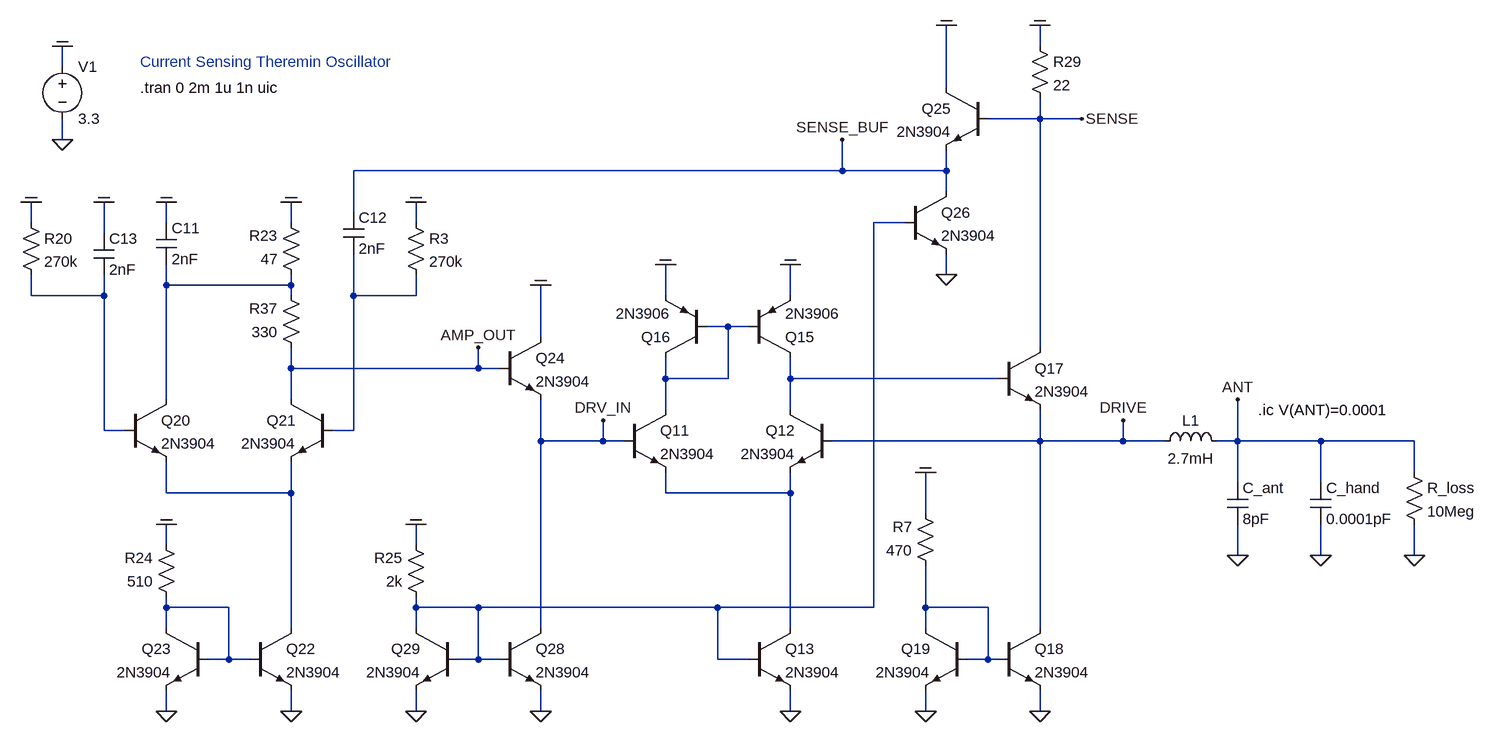
[diagram p0: schematic 2023_03_wallin_oscillator_bjt_diff_amp_volt_follower_buffer_v01.asc]
2023_03_wallin_oscillator_bjt_diff_amp_volt_follower_buffer_v01.asc, the LTspice schematic file:
Version 4
SHEET 1 16292 13396
WIRE 6640 9248 6640 9216
WIRE 5136 9280 5136 9248
WIRE 6496 9312 6496 9216
WIRE 6640 9360 6640 9328
WIRE 6640 9360 6560 9360
WIRE 6704 9360 6640 9360
WIRE 5136 9392 5136 9360
WIRE 6336 9440 6336 9392
WIRE 6336 9440 5584 9440
WIRE 6496 9440 6496 9408
WIRE 6496 9440 6336 9440
WIRE 6496 9472 6496 9440
WIRE 5584 9504 5584 9440
WIRE 5088 9520 5088 9488
WIRE 5296 9520 5296 9488
WIRE 5488 9520 5488 9488
WIRE 5680 9520 5680 9488
WIRE 6432 9520 6384 9520
WIRE 5200 9536 5200 9488
WIRE 6496 9600 6496 9568
WIRE 5296 9616 5296 9584
WIRE 5488 9616 5488 9600
WIRE 5488 9616 5296 9616
WIRE 5088 9632 5088 9600
WIRE 5200 9632 5200 9600
WIRE 5200 9632 5088 9632
WIRE 5488 9632 5488 9616
WIRE 5584 9632 5584 9568
WIRE 5680 9632 5680 9600
WIRE 5680 9632 5584 9632
WIRE 6064 9632 6064 9584
WIRE 6256 9632 6256 9584
WIRE 6160 9680 6128 9680
WIRE 6192 9680 6160 9680
WIRE 5872 9696 5872 9616
WIRE 6640 9712 6640 9360
WIRE 5488 9744 5488 9712
WIRE 5776 9744 5776 9712
WIRE 5776 9744 5488 9744
WIRE 5808 9744 5776 9744
WIRE 6064 9760 6064 9728
WIRE 6160 9760 6160 9680
WIRE 6160 9760 6064 9760
WIRE 6256 9760 6256 9728
WIRE 6576 9760 6256 9760
WIRE 5296 9792 5296 9616
WIRE 5488 9792 5488 9744
WIRE 6064 9808 6064 9760
WIRE 6256 9808 6256 9760
WIRE 5200 9840 5200 9632
WIRE 5232 9840 5200 9840
WIRE 5584 9840 5584 9632
WIRE 5584 9840 5552 9840
WIRE 5872 9856 5872 9792
WIRE 5968 9856 5968 9824
WIRE 5968 9856 5872 9856
WIRE 6000 9856 5968 9856
WIRE 6640 9856 6640 9808
WIRE 6640 9856 6320 9856
WIRE 6768 9856 6768 9824
WIRE 6768 9856 6640 9856
WIRE 6832 9856 6768 9856
WIRE 6944 9856 6944 9792
WIRE 6944 9856 6912 9856
WIRE 7072 9856 6944 9856
WIRE 7216 9856 7072 9856
WIRE 7216 9904 7216 9856
WIRE 6944 9920 6944 9856
WIRE 7072 9920 7072 9856
WIRE 5296 9936 5296 9888
WIRE 5488 9936 5488 9888
WIRE 5488 9936 5296 9936
WIRE 6064 9936 6064 9904
WIRE 6256 9936 6256 9904
WIRE 6256 9936 6064 9936
WIRE 6464 9968 6464 9904
WIRE 5296 10016 5296 9984
WIRE 5680 10016 5680 9984
WIRE 6944 10032 6944 9984
WIRE 7072 10032 7072 9984
WIRE 7216 10032 7216 9984
WIRE 5296 10112 5296 10096
WIRE 5392 10112 5296 10112
WIRE 5680 10112 5680 10096
WIRE 5776 10112 5680 10112
WIRE 6144 10112 5776 10112
WIRE 6384 10112 6384 9520
WIRE 6384 10112 6144 10112
WIRE 6464 10112 6464 10048
WIRE 6560 10112 6464 10112
WIRE 5296 10144 5296 10112
WIRE 5488 10144 5488 9936
WIRE 5680 10144 5680 10112
WIRE 5872 10144 5872 9856
WIRE 6256 10144 6256 9936
WIRE 6464 10144 6464 10112
WIRE 6640 10144 6640 9856
WIRE 5392 10192 5392 10112
WIRE 5392 10192 5360 10192
WIRE 5424 10192 5392 10192
WIRE 5776 10192 5776 10112
WIRE 5776 10192 5744 10192
WIRE 5808 10192 5776 10192
WIRE 6144 10192 6144 10112
WIRE 6192 10192 6144 10192
WIRE 6560 10192 6560 10112
WIRE 6560 10192 6528 10192
WIRE 6576 10192 6560 10192
WIRE 5296 10272 5296 10240
WIRE 5488 10272 5488 10240
WIRE 5680 10272 5680 10240
WIRE 5872 10272 5872 10240
WIRE 6256 10272 6256 10240
WIRE 6464 10272 6464 10240
WIRE 6640 10272 6640 10240
FLAG 5136 9392 0
FLAG 5136 9248 COM
FLAG 6944 10032 0
FLAG 6944 9792 ANT
FLAG 7072 10032 0
FLAG 7216 10032 0
FLAG 6768 9824 DRIVE
FLAG 6256 10272 0
FLAG 6064 9584 COM
FLAG 6256 9584 COM
FLAG 6640 9216 COM
FLAG 6640 10272 0
FLAG 6464 10272 0
FLAG 6464 9904 COM
FLAG 5296 9984 COM
FLAG 5872 9616 COM
FLAG 5488 9488 COM
FLAG 6496 9216 COM
FLAG 6496 9600 0
FLAG 5872 10272 0
FLAG 5680 10272 0
FLAG 5680 9984 COM
FLAG 5488 10272 0
FLAG 5296 10272 0
FLAG 5296 9488 COM
FLAG 5200 9488 COM
FLAG 5088 9488 COM
FLAG 5680 9488 COM
FLAG 6704 9360 SENSE
FLAG 6336 9392 SENSE_BUF
FLAG 5968 9824 DRV_IN
FLAG 5776 9712 AMP_OUT
SYMBOL voltage 5136 9264 R0
WINDOW 123 0 0 Left 0
WINDOW 39 0 0 Left 0
SYMATTR InstName V1
SYMATTR Value 3.3
SYMBOL cap 6928 9920 R0
SYMATTR InstName C_ant
SYMATTR Value 8pF
SYMBOL cap 7056 9920 R0
SYMATTR InstName C_hand
SYMATTR Value 0.0001pF
SYMBOL res 7200 9888 R0
WINDOW 0 36 40 Left 2
WINDOW 3 36 76 Left 2
SYMATTR InstName R_loss
SYMATTR Value 10Meg
SYMBOL ind 6816 9872 R270
WINDOW 0 32 56 VTop 2
WINDOW 3 5 56 VBottom 2
SYMATTR InstName L1
SYMATTR Value 2.7mH
SYMATTR SpiceLine Ipk=0.5 Rser=120 Cpar=1.1pF
SYMBOL npn 6000 9808 R0
SYMATTR InstName Q11
SYMATTR Value 2N3904
SYMBOL npn 6320 9808 M0
SYMATTR InstName Q12
SYMATTR Value 2N3904
SYMBOL npn 6192 10144 R0
SYMATTR InstName Q13
SYMATTR Value 2N3904
SYMBOL pnp 6192 9728 M180
SYMATTR InstName Q15
SYMATTR Value 2N3906
SYMBOL pnp 6128 9728 R180
SYMATTR InstName Q16
SYMATTR Value 2N3906
SYMBOL npn 6576 9712 R0
SYMATTR InstName Q17
SYMATTR Value 2N3904
SYMBOL npn 6576 10144 R0
SYMATTR InstName Q18
SYMATTR Value 2N3904
SYMBOL npn 6528 10144 M0
SYMATTR InstName Q19
SYMATTR Value 2N3904
SYMBOL res 6624 9232 R0
WINDOW 0 36 40 Left 2
WINDOW 3 36 76 Left 2
SYMATTR InstName R29
SYMATTR Value 22
SYMBOL npn 5232 9792 R0
SYMATTR InstName Q20
SYMATTR Value 2N3904
SYMBOL npn 5552 9792 M0
SYMATTR InstName Q21
SYMATTR Value 2N3904
SYMBOL npn 5424 10144 R0
SYMATTR InstName Q22
SYMATTR Value 2N3904
SYMBOL npn 5360 10144 M0
SYMATTR InstName Q23
SYMATTR Value 2N3904
SYMBOL res 5312 10112 R180
WINDOW 0 36 76 Left 2
WINDOW 3 36 40 Left 2
SYMATTR InstName R24
SYMATTR Value 510
SYMBOL res 5504 9728 R180
WINDOW 0 36 76 Left 2
WINDOW 3 36 40 Left 2
SYMATTR InstName R37
SYMATTR Value 330
SYMBOL res 5072 9504 R0
WINDOW 0 36 40 Left 2
WINDOW 3 36 76 Left 2
SYMATTR InstName R20
SYMATTR Value 270k
SYMBOL cap 5568 9504 R0
SYMATTR InstName C12
SYMATTR Value 2nF
SYMBOL cap 5184 9536 R0
SYMATTR InstName C13
SYMATTR Value 2nF
SYMBOL npn 5808 9696 R0
SYMATTR InstName Q24
SYMATTR Value 2N3904
SYMBOL res 5504 9616 R180
WINDOW 0 36 76 Left 2
WINDOW 3 36 40 Left 2
SYMATTR InstName R23
SYMATTR Value 47
SYMBOL cap 5280 9520 R0
SYMATTR InstName C11
SYMATTR Value 2nF
SYMBOL npn 6560 9312 M0
SYMATTR InstName Q25
SYMATTR Value 2N3904
SYMBOL npn 6432 9472 R0
SYMATTR InstName Q26
SYMATTR Value 2N3904
SYMBOL npn 5808 10144 R0
SYMATTR InstName Q28
SYMATTR Value 2N3904
SYMBOL npn 5744 10144 M0
SYMATTR InstName Q29
SYMATTR Value 2N3904
SYMBOL res 5696 10112 R180
WINDOW 0 36 76 Left 2
WINDOW 3 36 40 Left 2
SYMATTR InstName R25
SYMATTR Value 2k
SYMBOL res 5664 9504 R0
WINDOW 0 36 40 Left 2
WINDOW 3 36 76 Left 2
SYMATTR InstName R3
SYMATTR Value 270k
SYMBOL res 6480 10064 R180
WINDOW 0 36 76 Left 2
WINDOW 3 36 40 Left 2
SYMATTR InstName R7
SYMATTR Value 470
TEXT 5256 9312 Left 2 !.tran 0 2m 1u 1n uic
TEXT 5256 9272 Left 2 ;Current Sensing Theremin Oscillator
TEXT 6976 9808 Left 2 !.ic V(ANT)=0.0001

The netlist it stands for:
* 2023_03_wallin_oscillator_bjt_diff_amp_volt_follower_buffer_v01.asc
V1 COM 0 3.3
C_ant ANT 0 8pF
C_hand ANT 0 0.0001pF
R_loss ANT 0 10Meg
L1 DRIVE ANT 2.7mH Ipk=0.5 Rser=120 Cpar=1.1pF
Q11 N005 DRV_IN N008 0 2N3904
Q12 N006 DRIVE N008 0 2N3904
Q13 N008 N001 0 0 2N3904
Q15 N006 N005 COM 0 2N3906
Q16 N005 N005 COM 0 2N3906
Q17 SENSE N006 DRIVE 0 2N3904
Q18 DRIVE N010 0 0 2N3904
Q19 N010 N010 0 0 2N3904
R29 COM SENSE 22
Q20 N002 N003 N007 0 2N3904
Q21 AMP_OUT N004 N007 0 2N3904
Q22 N007 N009 0 0 2N3904
Q23 N009 N009 0 0 2N3904
R24 N009 COM 510
R37 AMP_OUT N002 330
R20 COM N003 270k
C12 SENSE_BUF N004 2nF
C13 COM N003 2nF
Q24 COM AMP_OUT DRV_IN 0 2N3904
R23 N002 COM 47
C11 COM N002 2nF
Q25 COM SENSE SENSE_BUF 0 2N3904
Q26 SENSE_BUF N001 0 0 2N3904
Q28 DRV_IN N001 0 0 2N3904
Q29 N001 N001 0 0 2N3904
R25 N001 COM 2k
R3 COM N004 270k
R7 N010 COM 470
.model NPN NPN
.model PNP PNP
.lib standard.bjt
.tran 0 2m 1u 1n uic
* Current Sensing Theremin Oscillator
.ic V(ANT)=0.0001
.backanno
.end